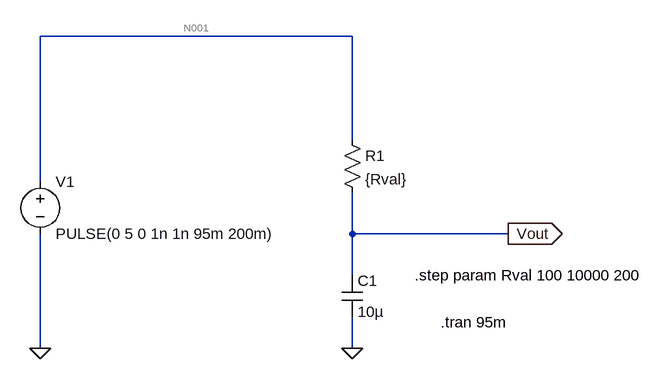
[diagram p0: schematic rc_normal_sweep.asc]
rc_normal_sweep.asc, the LTspice schematic file:
Version 4.1
SHEET 1 880 680
WIRE -512 -64 -992 -64
WIRE -512 96 -512 -64
WIRE -992 160 -992 -64
WIRE -512 240 -512 176
WIRE -272 240 -512 240
WIRE -512 304 -512 240
WIRE -992 416 -992 240
WIRE -512 416 -512 368
FLAG -272 240 Vout
IOPIN -272 240 Out
FLAG -992 416 0
FLAG -512 416 0
SYMBOL voltage -992 144 R0
WINDOW 123 0 0 Left 0
WINDOW 39 0 0 Left 0
SYMATTR InstName V1
SYMATTR Value PULSE(0 5 0 1n 1n 95m 200m)
SYMBOL res -528 80 R0
SYMATTR InstName R1
SYMATTR Value {Rval}
SYMBOL cap -528 304 R0
SYMATTR InstName C1
SYMATTR Value 10µ
SYMATTR SpiceLine V=6.3 Irms=0 Rser=4 Lser=0 mfg="AVX" pn="TAJA106M006" type="Tantalum"
TEXT -376 376 Left 2 !.tran 95m
TEXT -416 304 Left 2 !.step param Rval 100 10000 200

The netlist it stands for:
* rc_normal_sweep.asc
V1 N001 0 PULSE(0 5 0 1n 1n 95m 200m)
R1 N001 Vout {Rval}
C1 Vout 0 10µ V=6.3 Irms=0 Rser=4 Lser=0 mfg="AVX" pn="TAJA106M006" type="Tantalum"
.tran 95m
.step param Rval 100 10000 200
.backanno
.end

* Results of the author's LTspice run, read from the files saved beside the schematic
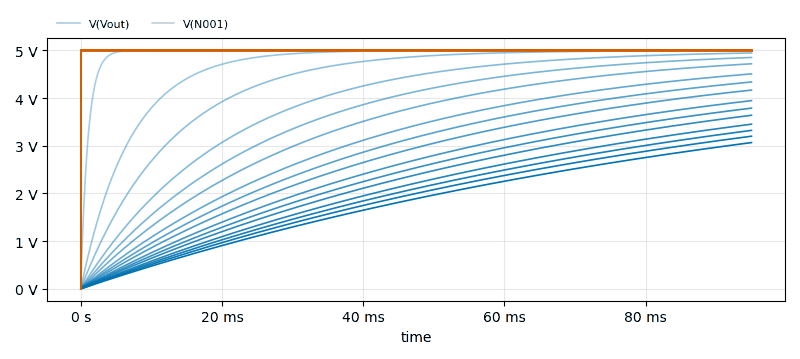
[diagram p1: Transient Analysis of rc_normal_sweep.asc, plotted from the saved traces]
* Transient Analysis, 51 runs:
*   V(Vout) [run 1]: min 0 V, max 5 V, average 4.947 V, rms 4.96 V, last 5 V
*   V(Vout) [run 2]: min 0 V, max 5 V, average 4.632 V, rms 4.715 V, last 5 V
*   V(Vout) [run 3]: min 0 V, max 4.997 V, average 4.316 V, rms 4.457 V, last 4.997 V
*   V(Vout) [run 4]: min 0 V, max 4.945 V, average 3.907 V, rms 4.102 V, last 4.945 V
*   V(Vout) [run 5]: min 0 V, max 4.851 V, average 3.621 V, rms 3.842 V, last 4.851 V
*   V(Vout) [run 6]: min 0 V, max 4.718 V, average 3.361 V, rms 3.596 V, last 4.718 V
*   V(Vout) [run 7]: min 0 V, max 4.507 V, average 3.055 V, rms 3.3 V, last 4.507 V
*   V(Vout) [run 8]: min 0 V, max 4.337 V, average 2.855 V, rms 3.101 V, last 4.337 V
*   V(N001) [run 1]: min 0 V, max 5 V, average 5 V, rms 5 V, last 5 V
*   V(N001) [run 2]: min 0 V, max 5 V, average 5 V, rms 5 V, last 5 V
*   V(N001) [run 3]: min 0 V, max 5 V, average 5 V, rms 5 V, last 5 V
*   V(N001) [run 4]: min 0 V, max 5 V, average 5 V, rms 5 V, last 5 V
*   V(N001) [run 5]: min 0 V, max 5 V, average 5 V, rms 5 V, last 5 V
*   V(N001) [run 6]: min 0 V, max 5 V, average 5 V, rms 5 V, last 5 V
*   V(N001) [run 7]: min 0 V, max 5 V, average 5 V, rms 5 V, last 5 V
*   V(N001) [run 8]: min 0 V, max 5 V, average 5 V, rms 5 V, last 5 V